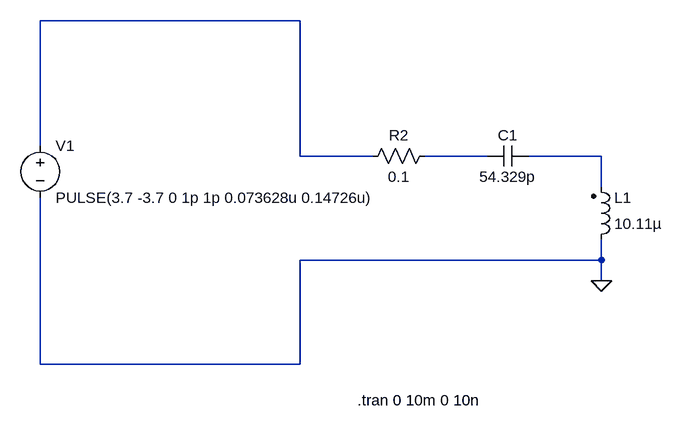
[diagram p0: schematic dumb.asc]
dumb.asc, the LTspice schematic file:
Version 4
SHEET 1 2368 796
WIRE -80 -96 -480 -96
WIRE -480 96 -480 -96
WIRE -80 112 -80 -96
WIRE 32 112 -80 112
WIRE 208 112 112 112
WIRE 384 112 272 112
WIRE 384 160 384 112
WIRE 384 272 384 240
WIRE 384 272 -80 272
WIRE 384 304 384 272
WIRE -480 432 -480 176
WIRE -80 432 -80 272
WIRE -80 432 -480 432
FLAG 384 304 0
SYMBOL voltage -480 80 R0
WINDOW 123 0 0 Left 0
WINDOW 39 0 0 Left 0
SYMATTR InstName V1
SYMATTR Value PULSE(3.7 -3.7 0 1p 1p 0.073628u 0.14726u)
SYMBOL cap 272 96 R90
WINDOW 0 0 32 VBottom 2
WINDOW 3 32 32 VTop 2
SYMATTR InstName C1
SYMATTR Value 54.329p
SYMBOL ind2 368 256 M180
WINDOW 0 36 80 Left 2
WINDOW 3 36 40 Left 2
SYMATTR InstName L1
SYMATTR Value 10.11µ
SYMATTR Type ind
SYMBOL res 128 96 R90
WINDOW 0 0 56 VBottom 2
WINDOW 3 32 56 VTop 2
SYMATTR InstName R2
SYMATTR Value 0.1
TEXT 8 488 Left 2 !.tran 0 10m 0 10n

The netlist it stands for:
* dumb.asc
V1 N001 0 PULSE(3.7 -3.7 0 1p 1p 0.073628u 0.14726u)
C1 N003 N002 54.329p
L1 0 N003 10.11µ
R2 N002 N001 0.1
.tran 0 10m 0 10n
.backanno
.end